# Altium schematic sheet 03-MEMORY.SchDoc
size A
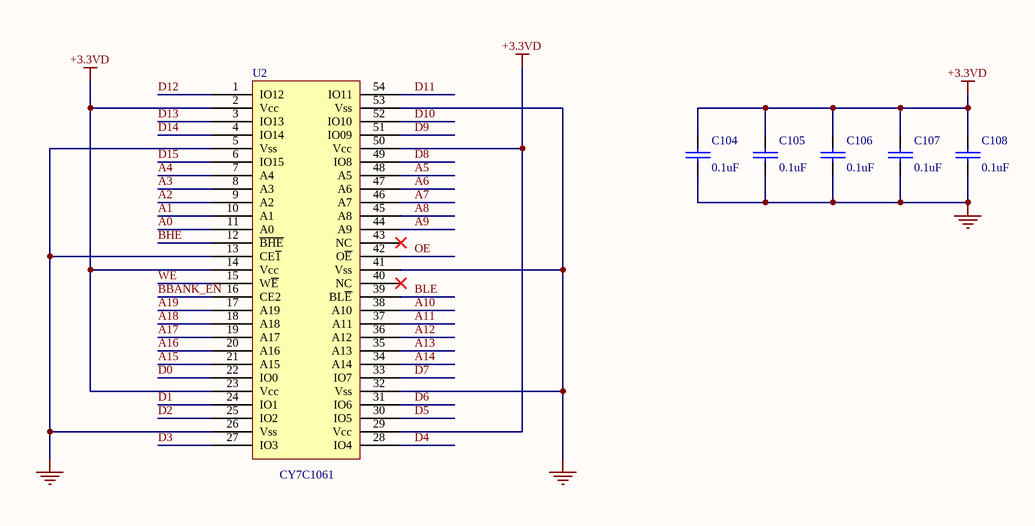
[diagram p0: 03-MEMORY.SchDoc]

## Parts
C104  0.1uF  [0603]
C105  0.1uF  [0603]
C106  0.1uF  [0603]
C107  0.1uF  [0603]
C108  0.1uF  [0603]
U2  CY7C1061  [TSOP54]

## Nets
+3.3VD: C104.1 C105.1 C106.1 C107.1 C108.1 U2.2(Vcc) U2.14(Vcc) U2.23(Vcc) U2.29(Vcc) U2.50(Vcc)
DGND: C104.2 C105.2 C106.2 C107.2 C108.2 U2.5(Vss) U2.13(CE~{1}) U2.26(Vss) U2.32(Vss) U2.41(Vss) U2.53(Vss)
A0: U2.11(A0)
A1: U2.10(A1)
A2: U2.9(A2)
A3: U2.8(A3)
A4: U2.7(A4)
A5: U2.48(A5)
A6: U2.47(A6)
A7: U2.46(A7)
A8: U2.45(A8)
A9: U2.44(A9)
A10: U2.38(A10)
A11: U2.37(A11)
A12: U2.36(A12)
A13: U2.35(A13)
A14: U2.34(A14)
A15: U2.21(A15)
A16: U2.20(A16)
A17: U2.19(A17)
A18: U2.18(A18)
A19: U2.17(A19)
BBANK_EN: U2.16(CE2)
BHE: U2.12(~{BHE})
BLE: U2.39(BL~{E})
D0: U2.22(IO0)
D1: U2.24(IO1)
D2: U2.25(IO2)
D3: U2.27(IO3)
D4: U2.28(IO4)
D5: U2.30(IO5)
D6: U2.31(IO6)
D7: U2.33(IO7)
D8: U2.49(IO8)
D9: U2.51(IO09)
D10: U2.52(IO10)
D11: U2.54(IO11)
D12: U2.1(IO12)
D13: U2.3(IO13)
D14: U2.4(IO14)
D15: U2.6(IO15)
OE: U2.42(O~{E})
WE: U2.15(W~{E})

Not connected (* = marked no-connect by the designer): U2 40(NC)* 43(NC)*

## Library data of the parts
C104-C108 = CAP: Capacitor
U2 = CY7C1061: CY7C1061AC